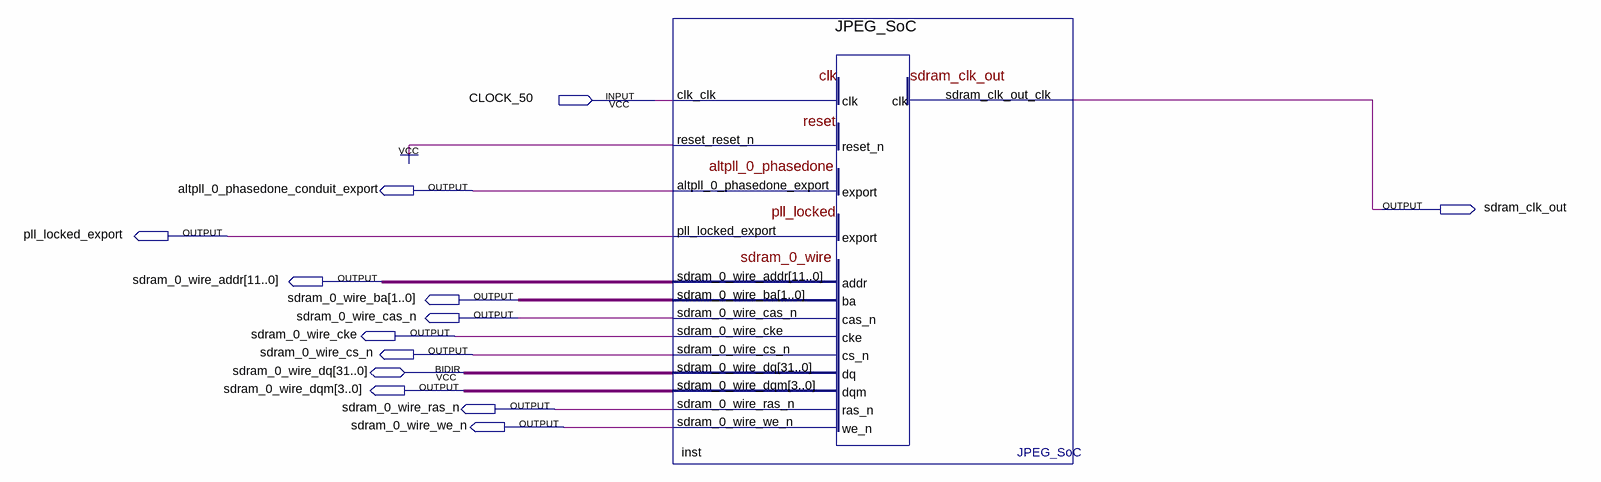
[diagram p0: schematic sheet]
// Quartus schematic toplevel.bdf as structural Verilog: 1 symbols, 13 pins
module toplevel (
  input  CLOCK_50,
  inout  [31:0] sdram_0_wire_dq,
  output altpll_0_phasedone_conduit_export,
  output sdram_clk_out,
  output pll_locked_export,
  output [11:0] sdram_0_wire_addr,
  output [1:0] sdram_0_wire_ba,
  output sdram_0_wire_cas_n,
  output sdram_0_wire_cke,
  output sdram_0_wire_cs_n,
  output [3:0] sdram_0_wire_dqm,
  output sdram_0_wire_ras_n,
  output sdram_0_wire_we_n
);

  JPEG_SoC inst (
    .clk_clk(CLOCK_50), .reset_reset_n(1'b1), .altpll_0_phasedone_export(altpll_0_phasedone_conduit_export),
    .pll_locked_export(pll_locked_export), .sdram_clk_out_clk(sdram_clk_out),
    .sdram_0_wire_addr(sdram_0_wire_addr), .sdram_0_wire_ba(sdram_0_wire_ba),
    .sdram_0_wire_cas_n(sdram_0_wire_cas_n), .sdram_0_wire_cke(sdram_0_wire_cke),
    .sdram_0_wire_cs_n(sdram_0_wire_cs_n), .sdram_0_wire_dqm(sdram_0_wire_dqm),
    .sdram_0_wire_ras_n(sdram_0_wire_ras_n), .sdram_0_wire_we_n(sdram_0_wire_we_n),
    .sdram_0_wire_dq(sdram_0_wire_dq));
endmodule
